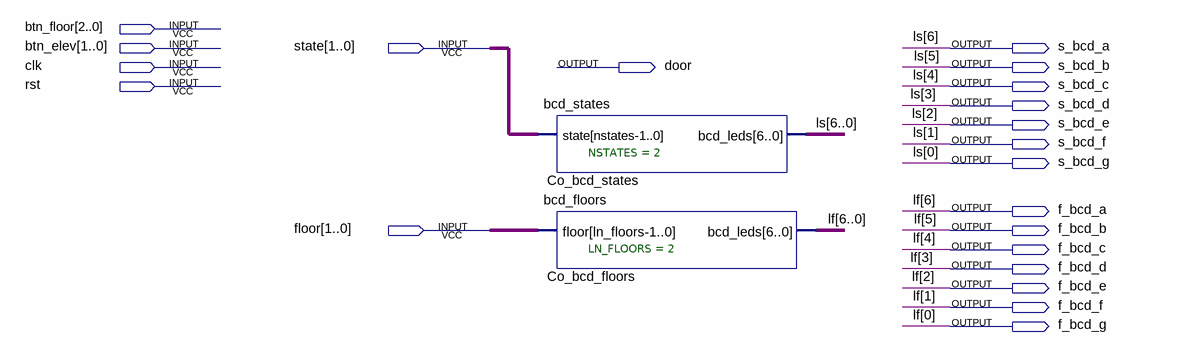
[diagram p0: schematic sheet]
// Quartus schematic lab09.bdf as structural Verilog: 2 symbols, 21 pins
module lab09 (
  input  [2:0] btn_floor,
  input  [1:0] btn_elev,
  input  [1:0] state,
  input  clk,
  input  rst,
  input  [1:0] floor,
  output s_bcd_a,
  output door,
  output s_bcd_b,
  output s_bcd_c,
  output s_bcd_d,
  output s_bcd_e,
  output s_bcd_f,
  output s_bcd_g,
  output f_bcd_a,
  output f_bcd_b,
  output f_bcd_c,
  output f_bcd_d,
  output f_bcd_e,
  output f_bcd_f,
  output f_bcd_g
);

  bcd_states #(.NSTATES(2)) Co_bcd_states (
    .state(state), .bcd_leds({s_bcd_a, s_bcd_b, s_bcd_c, s_bcd_d, s_bcd_e, s_bcd_f, s_bcd_g}));
  bcd_floors #(.LN_FLOORS(2)) Co_bcd_floors (
    .floor(floor), .bcd_leds({f_bcd_a, f_bcd_b, f_bcd_c, f_bcd_d, f_bcd_e, f_bcd_f, f_bcd_g}));

  // Other names for the same wires on the sheet: lf[6:0] = {f_bcd_a, f_bcd_b, f_bcd_c, f_bcd_d, f_bcd_e, f_bcd_f, f_bcd_g};
  //   ls[6:0] = {s_bcd_a, s_bcd_b, s_bcd_c, s_bcd_d, s_bcd_e, s_bcd_f, s_bcd_g}
endmodule
